# EAGLE schematic Arduino_PowerMeter_Shield (EAGLE 7.6.0)
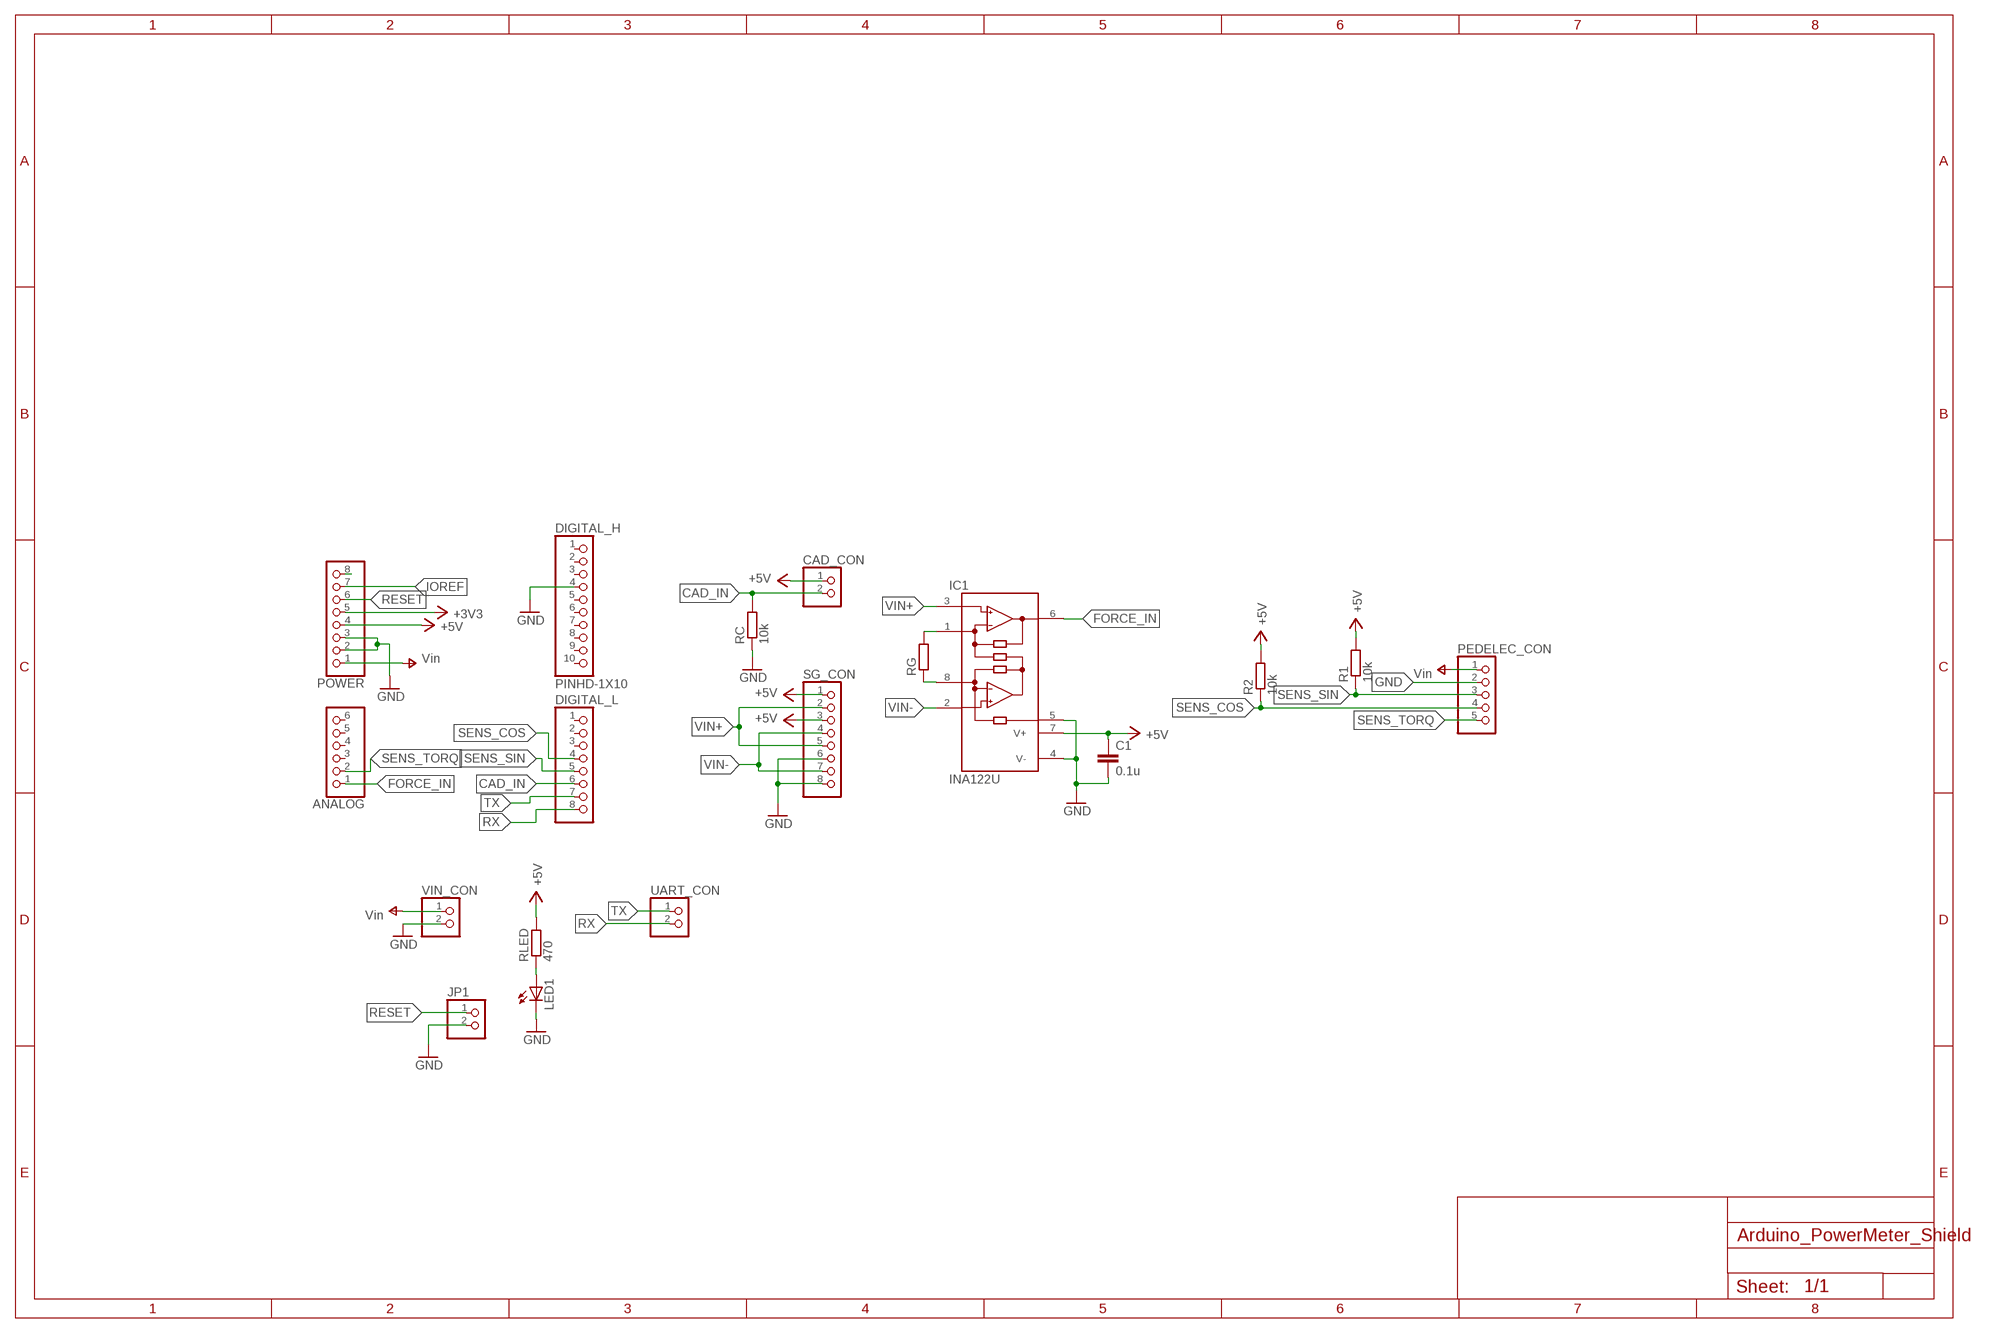
[diagram p0: schematic, sheet 1]

## Parts
ANALOG  PINHD-1X6B  [1X06-BIG]
C1  0.1u  C-EUC0603  [C0603]
CAD_CON  PINHD-1X2/90  [1X02/90]
DIGITAL_H  PINHD-1X10  [1X10-BIG]
DIGITAL_L  PINHD-1X8BIG  [1X08-BIG]
IC1  INA122U  [SO08]
JP1  PINHD-1X2  [1X02]
LED1  LEDCHIPLED_0603  [CHIPLED_0603]
PEDELEC_CON  PINHD-1X5/90  [1X05/90]
POWER  PINHD-1X8BIG  [1X08-BIG]
R1  10k  R-EU_R0603  [R0603]
R2  10k  R-EU_R0603  [R0603]
RC  10k  R-EU_R0603  [R0603]
RG  R-EU_R0603  [R0603]
RLED  470  R-EU_R0603  [R0603]
SG_CON  PINHD-1X8/90  [1X08/90]
UART_CON  PINHD-1X2/90  [1X02/90]
VIN_CON  PINHD-1X2/90  [1X02/90]

## Nets
+3V3: POWER.5
+5V [usbvcc]: C1.1 CAD_CON.1 IC1.7(V+) POWER.4 R1.2 R2.2 RLED.2 SG_CON.1 SG_CON.3
CAD_IN: CAD_CON.2 DIGITAL_L.6 RC.2
FORCE_IN: ANALOG.1 IC1.6(OUT)
GND: C1.2 DIGITAL_H.4 IC1.4(V-) IC1.5(REF) JP1.2 LED1.C PEDELEC_CON.2 POWER.2 POWER.3 RC.1 SG_CON.6 SG_CON.8 VIN_CON.2
IOREF: POWER.7
N$1: POWER.8
N$2: IC1.1(RG) RG.2
N$3: IC1.8(RG) RG.1
N$4: LED1.A RLED.1
RESET: JP1.1 POWER.6
RX: DIGITAL_L.8 UART_CON.2
SENS_COS: DIGITAL_L.4 PEDELEC_CON.4 R2.1
SENS_SIN: DIGITAL_L.5 PEDELEC_CON.3 R1.1
SENS_TORQ: ANALOG.2 PEDELEC_CON.5
TX: DIGITAL_L.7 UART_CON.1
V+ [power]: PEDELEC_CON.1 POWER.1 VIN_CON.1 ; supply symbol labelled Vin
VIN+: IC1.3(+IN) SG_CON.2 SG_CON.5
VIN-: IC1.2(-IN) SG_CON.4 SG_CON.7
Unconnected: ANALOG.3 ANALOG.4 ANALOG.5 ANALOG.6 DIGITAL_H.1 DIGITAL_H.2 DIGITAL_H.3 DIGITAL_H.5 DIGITAL_H.6 DIGITAL_H.7 DIGITAL_H.8 DIGITAL_H.9 DIGITAL_H.10 DIGITAL_L.1 DIGITAL_L.2 DIGITAL_L.3

## Library data of the parts
ANALOG = adafruit:PINHD-1X6: PIN HEADER
C1 = rcl:C-EU: CAPACITOR, European symbol
CAD_CON JP1 UART_CON VIN_CON = pinhead:PINHD-1X2: PIN HEADER
DIGITAL_H = adafruit:PINHD-1X10: Pin header 1x10 0.1" spacing With round pins
DIGITAL_L POWER = adafruit:PINHD-1X8: PIN HEADER
IC1 = burr-brown:INA122: Instrumentation Amplifier Single Supply, MicroPower; MPN: INA122U; OC_FARNELL: 1212407; OC_NEWARK: 97K1918
LED1 = adafruit:LED: LED OSRAM: - CHIPLED LG R971, LG N971, LY N971, LG Q971, LY Q971, LO R971, LY R971 LH N974, LH R974 LS Q976, LO Q976, LY Q976 LO Q996 - Hyper CHIPLED LW Q18S LB Q993, LB Q99A, LB R99A - SideLED LS A670, LO A670, LY A670, LG A670, LP A670 LB A673, LV A673, LT A673, LW A673 LH A674 LY A675 LS A676, LA A676, LO A676, LY A676, LW A676 LS A679, LY A679, LG A679 - Hyper Micro SIDELED® LS Y876, LA Y876, LO Y876, LY Y876 LT Y87S - SmartLED LW L88C, LW L88S LB L89C, LB L89S, LG L890 LS L89K, LO L89K, LY L89K LS L896, LA L896, LO L896, LY L896 - TOPLED LS T670, LO T670, LY T670, LG T670, LP T670 LSG T670, LSP T670, LSY T670, LOP T670, LYG T670 LG T671, LOG T671, LSG T671 LB T673, LV T673, LT T673, LW T673 LH T674 LS T676, LA T676, LO T676, LY T676, LB T676, LH T676, LSB T676, LW T676 LB T67C, LV T67C, LT T67C, LS T67K, LO T67K, LY T67K, LW E67C LS E67B, LA E67B, LO E67B, LY E67B, LB E67C, LV E67C, LT E67C LW T67C LS T679, LY T679, LG T679 LS T770, LO T770, LY T770, LG T770, LP T770 LB T773, LV T773, LT T773, LW T773 LH T774 LS E675, LA E675, LY E675, LS T675 LS T776, LA T776, LO T776, LY T776, LB T776 LHGB T686 LT T68C, LB T68C - Hyper Mini TOPLED® LB M676 - Mini TOPLED Santana® LG M470 LS M47K, LO M47K, LY M47K Source: http://www.osram.convergy.de/
PEDELEC_CON = pinhead:PINHD-1X5: PIN HEADER
R1 R2 RC RG RLED = rcl:R-EU_: RESISTOR, European symbol
SG_CON = pinhead:PINHD-1X8: PIN HEADER

## Net classes
0 default: width 0.203 mm, drill 0.305 mm, clearance 0.203 mm
3 usbvcc: width 0.203 mm, drill 0.305 mm, clearance 0.203 mm